# EAGLE design 8080_pod (EAGLE 6.6.0)
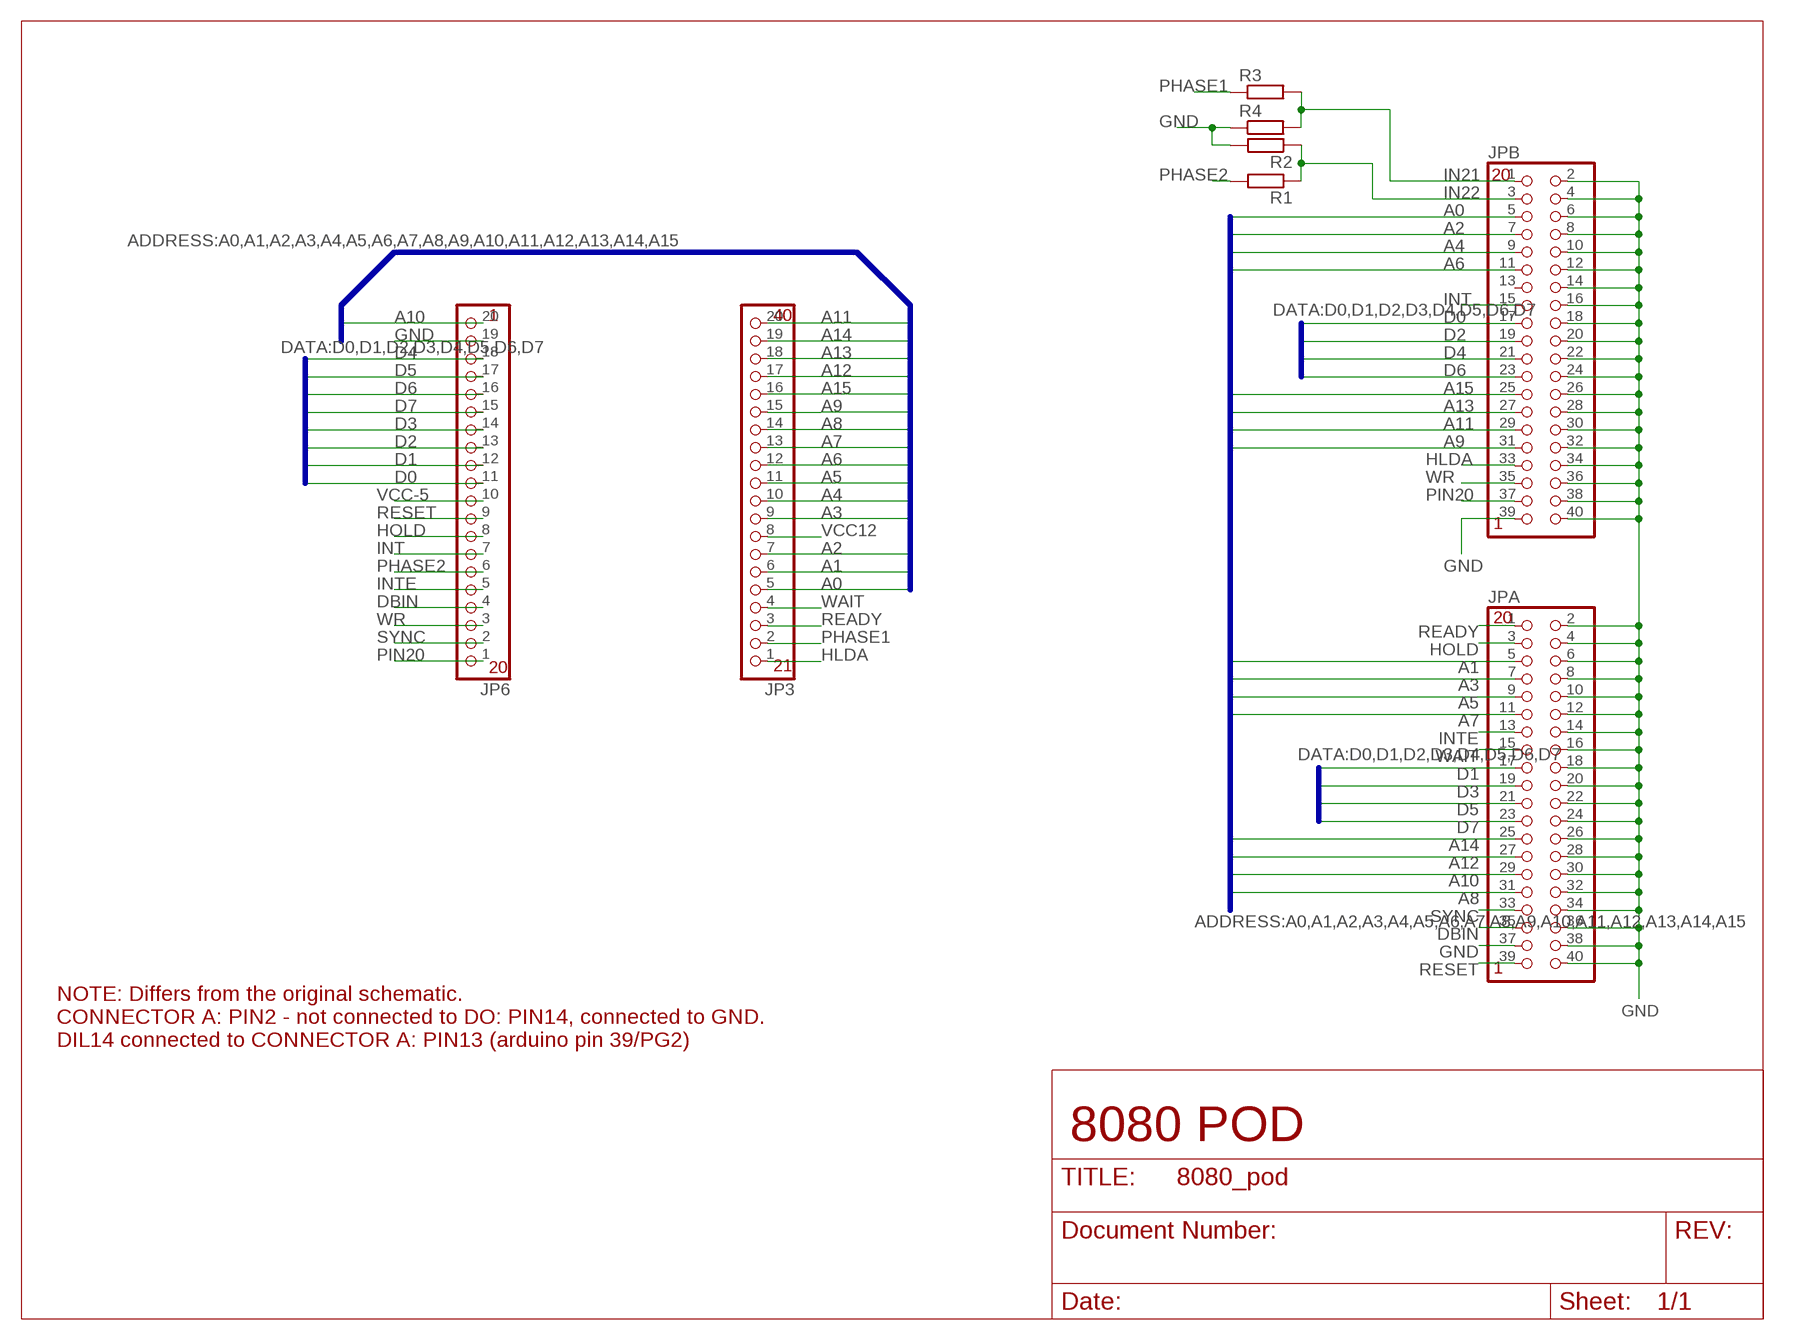
[diagram p0: schematic, sheet 1]

## Parts
JP3  PINHD-1X20-BIG  [1X20-BIG]
JP6  PINHD-1X20-BIG  [1X20-BIG]
JPA  PINHD-2X20-BIG  [2X20-BIG]
JPB  PINHD-2X20-BIG  [2X20-BIG]
R1  R-EU_0207/10  [0207/10]
R2  R-EU_0207/10  [0207/10]
R3  R-EU_0207/10  [0207/10]
R4  R-EU_0207/10  [0207/10]

## Nets
A0: JP3.5 JPB.5
A1: JP3.6 JPA.5
A2: JP3.7 JPB.7
A3: JP3.9 JPA.7
A4: JP3.10 JPB.9
A5: JP3.11 JPA.9
A6: JP3.12 JPB.11
A7: JP3.13 JPA.11
A8: JP3.14 JPA.31
A9: JP3.15 JPB.31
A10: JP6.20 JPA.29
A11: JP3.20 JPB.29
A12: JP3.17 JPA.27
A13: JP3.18 JPB.27
A14: JP3.19 JPA.25
A15: JP3.16 JPB.25
D0: JP6.11 JPB.17
D1: JP6.12 JPA.17
D2: JP6.13 JPB.19
D3: JP6.14 JPA.19
D4: JP6.18 JPB.21
D5: JP6.17 JPA.21
D6: JP6.16 JPB.23
D7: JP6.15 JPA.23
DBIN: JP6.4 JPA.35
GND: JP6.19 JPA.2 JPA.4 JPA.6 JPA.8 JPA.10 JPA.12 JPA.14 JPA.16 JPA.18 JPA.20 JPA.22 JPA.24 JPA.26 JPA.28 JPA.30 JPA.32 JPA.34 JPA.36 JPA.37 JPA.38 JPA.40 JPB.2 JPB.4 JPB.6 JPB.8 JPB.10 JPB.12 JPB.14 JPB.16 JPB.18 JPB.20 JPB.22 JPB.24 JPB.26 JPB.28 JPB.30 JPB.32 JPB.34 JPB.36 JPB.38 JPB.39 JPB.40 R2.2 R4.1
HLDA: JP3.1 JPB.33
HOLD: JP6.8 JPA.3
IN21: JPB.1 R3.2 R4.2
IN22: JPB.3 R1.1 R2.1
INT: JP6.7 JPB.15
INTE: JP6.5 JPA.13
PHASE1: JP3.2 R3.1
PHASE2: JP6.6 R1.2
PIN20: JP6.1 JPB.37
READY: JP3.3 JPA.1
RESET: JP6.9 JPA.39
SYNC: JP6.2 JPA.33
VCC12: JP3.8
VCC-5: JP6.10
WAIT: JP3.4 JPA.15
WR: JP6.3 JPB.35
Unconnected: JPB.13

## Buses
DATA:D0,D1,D2,D3,D4,D5,D6,D7
ADDRESS:A0,A1,A2,A3,A4,A5,A6,A7,A8,A9,A10,A11,A12,A13,A14,A15

## Notes on the sheet
- 20
- 1 | 40
- 1
- 20
- 20 | 21
- 1
- NOTE: Differs from the original schematic.
  CONNECTOR A: PIN2 - not connected to DO: PIN14, connected to GND. 
  DIL14 connected to CONNECTOR A: PIN13 (arduino pin 39/PG2)
- 8080 POD

## Library data of the parts
JP3 JP6 = adafruit:PINHD-1X20: PIN HEADER
JPA JPB = adafruit:PINHD-2X20: PIN HEADER
R1-R4 = rcl:R-EU_: RESISTOR, European symbol

## Board
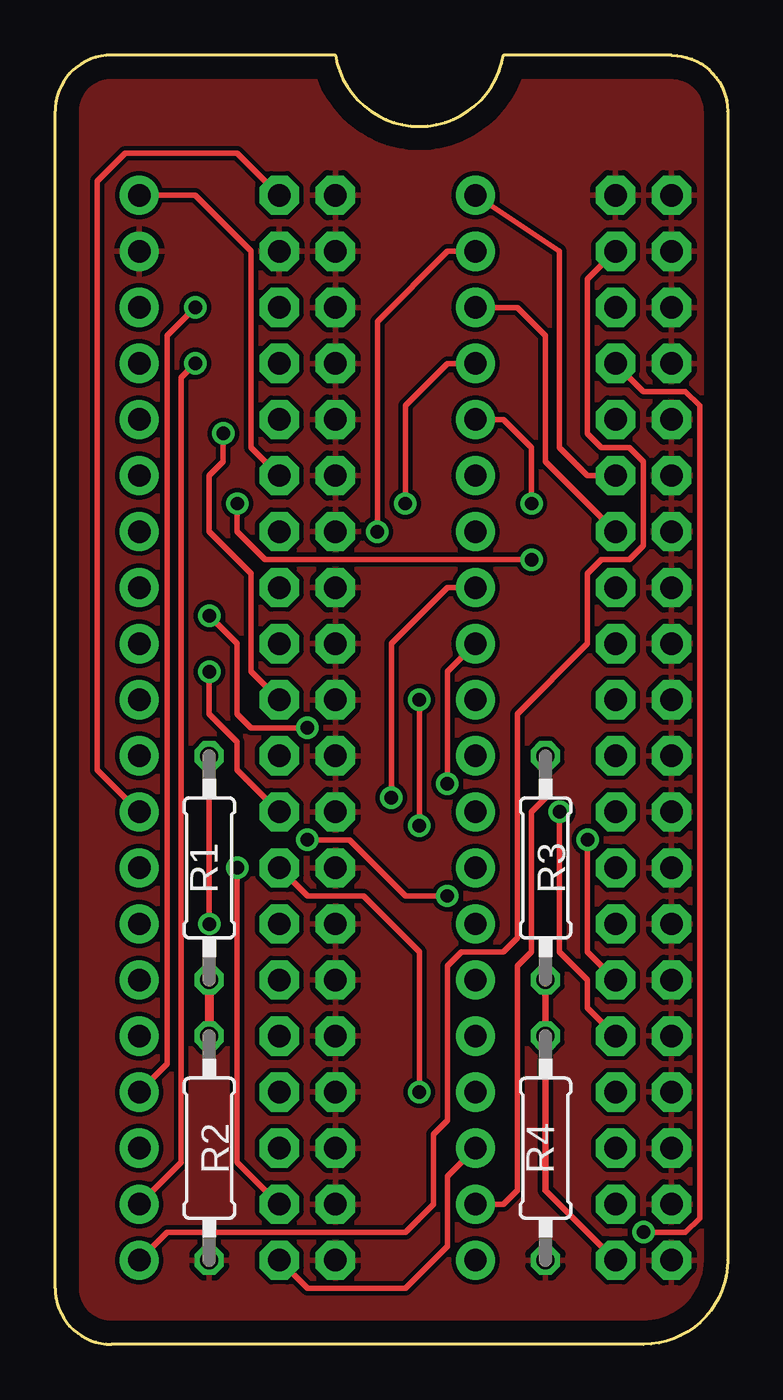
[diagram p1: board, top side]
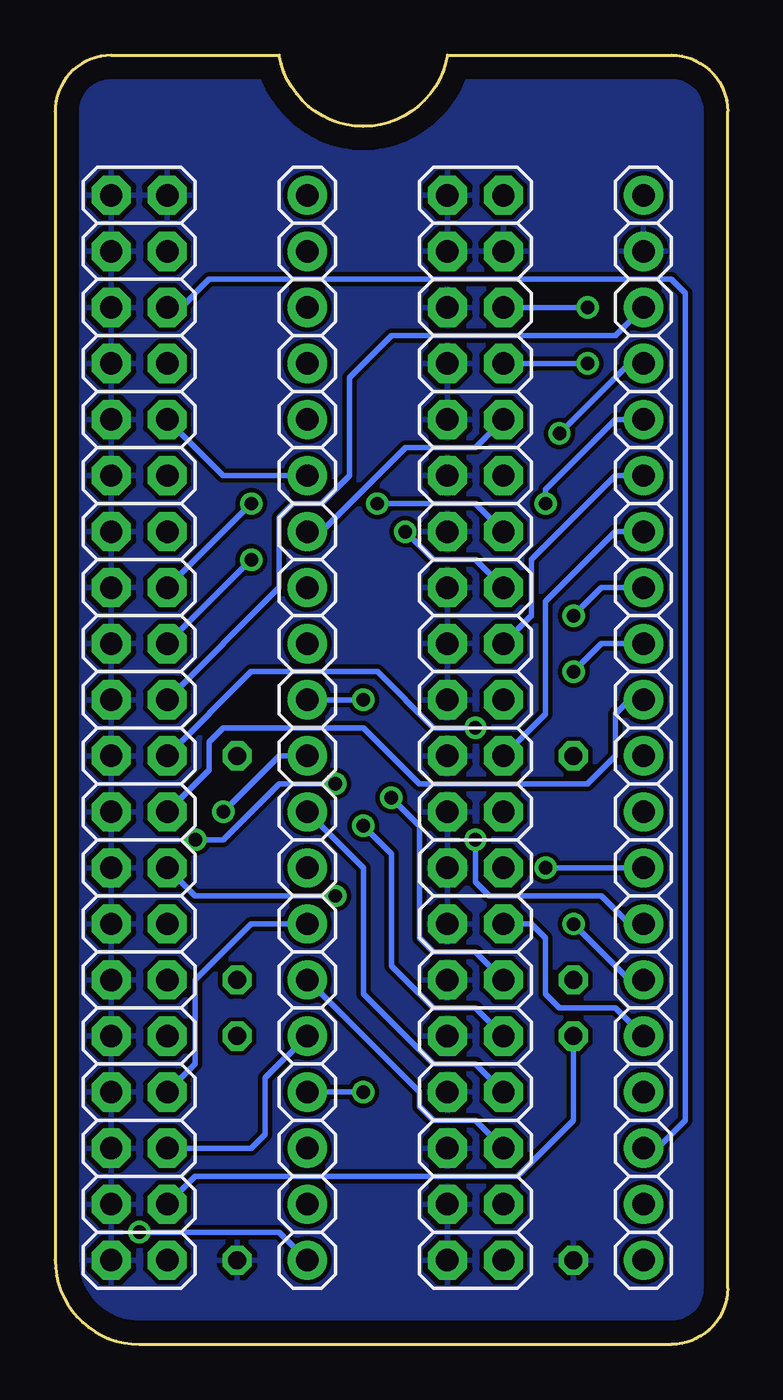
[diagram p2: board, bottom side, seen from below]

Size 30.48 x 58.42 mm. Coordinates in mm from the lower left corner, seen from the top.
Outline: 0,2.56 0,55.86
Outline: 27.95,58.41 arc-90 30.48,55.88 30.48,3.81 arc-90 26.67,0 2.54,0 arc-90 0,2.54
Outline: 27.94,58.42 20.32,58.42 arc-161 12.7,58.42 2.54,58.42 arc90 0,55.88
Copper layers (1*16): Top 0.035mm / dielectric 1.5mm / Bottom 0.035mm
Design rules "default": minimum track width 10mil, minimum drill 24mil, track to track 8mil, track to pad 8mil, pad to pad 8mil, via to via 8mil, smd to smd 8mil, copper to edge 40mil, drill to drill 8mil, minimum pad ring 10mil, minimum via ring 8mil, stop-mask expansion 4mil, vias tented up to drill 0mil, thermal gap 10mil

### Footprints (pad centres in the part's own frame; a part is rotated, then mirrored left to right if it is on the bottom)
1X20-BIG = drill 1.016 pad 1.778: 1 -24.13,0; 2 -21.59,0; 3 -19.05,0; 4 -16.51,0; 5 -13.97,0; 6 -11.43,0; 7 -8.89,0; 8 -6.35,0; 9 -3.81,0; 10 -1.27,0; 11 1.27,0; 12 3.81,0; 13 6.35,0; 14 8.89,0; 15 11.43,0; 16 13.97,0; 17 16.51,0; 18 19.05,0; 19 21.59,0; 20 24.13,0
2X20-BIG = drill 1.016 pad 1.778 octagon: 1 -24.13,-1.27; 2 -24.13,1.27; 3 -21.59,-1.27; 4 -21.59,1.27; 5 -19.05,-1.27; 6 -19.05,1.27; 7 -16.51,-1.27; 8 -16.51,1.27; 9 -13.97,-1.27; 10 -13.97,1.27; 11 -11.43,-1.27; 12 -11.43,1.27; 13 -8.89,-1.27; 14 -8.89,1.27; 15 -6.35,-1.27; 16 -6.35,1.27; 17 -3.81,-1.27; 18 -3.81,1.27; 19 -1.27,-1.27; 20 -1.27,1.27; 21 1.27,-1.27; 22 1.27,1.27; 23 3.81,-1.27; 24 3.81,1.27; 25 6.35,-1.27; 26 6.35,1.27; 27 8.89,-1.27; 28 8.89,1.27; 29 11.43,-1.27; 30 11.43,1.27; 31 13.97,-1.27; 32 13.97,1.27; 33 16.51,-1.27; 34 16.51,1.27; 35 19.05,-1.27; 36 19.05,1.27; 37 21.59,-1.27; 38 21.59,1.27; 39 24.13,-1.27; 40 24.13,1.27
0207/10 = drill 0.813 octagon: 1 -5.08,0; 2 5.08,0

### Placement (x,y rotation side)
JP3  19.05,27.94 90 bottom
JP6  3.81,27.94 90 bottom
JPA  11.43,27.94 90 bottom
JPB  26.67,27.94 90 bottom
R1  6.98,21.59 90 top
R2  6.98,8.89 270 top
R3  22.23,21.59 270 top
R4  22.23,8.89 90 top

### Tracks (layer width: path | path; a pad name or v marks a point on that pad's centre or on a via)
A0
  Bottom 0.254: JP3.5 20.95,12.06 20.95,9.53 21.59,8.89 JPB.5
A1
  Bottom 0.254: JPA.5 11.43,10.16 13.33,10.16 13.97,10.79 13.97,11.43 JP3.6
A2
  Bottom 0.254: JPB.7 24.13,12.7 24.13,16.51 21.59,19.05 JP3.7
A3
  Bottom 0.254: JPA.7 11.43,12.7 13.33,12.7 16.51,15.88 16.51,21.59 JP3.9
A4  (via drill 0.61)
  Top 0.254: v22.86,24.13 22.86,17.78 24.13,16.51 24.13,15.24 JPB.9
  Bottom 0.254: JP3.10 20.32,26.67 v22.86,24.13
A5  (via drill 0.61)
  Top 0.254: v16.51,29.21 v16.51,23.5
  Bottom 0.254: JPA.9 11.43,15.24 13.33,15.24 15.24,17.14 15.24,22.23 v16.51,23.5 | JP3.11 v16.51,29.21
A6  (via drill 0.61)
  Top 0.254: JP3.12 17.78,30.48 v17.78,25.4 | v24.13,22.86 24.13,17.78 JPB.11
  Bottom 0.254: v17.78,25.4 20.32,25.4 22.86,22.86 v24.13,22.86
A7  (via drill 0.61)
  Top 0.254: v15.24,24.77 15.24,31.75 17.78,34.29 JP3.13
  Bottom 0.254: JPA.11 11.43,17.78 13.33,17.78 13.97,18.41 13.97,23.5 v15.24,24.77
A8
  Bottom 0.254: JPA.31 11.43,40.64 14.6,40.64 18.41,36.83 JP3.14
A9
  Bottom 0.254: JP3.15 22.86,39.37 JPB.31
A10
  Top 0.254: JP6.20 6.35,52.07 8.89,49.53 8.89,40.64 JPA.29
A11
  Top 0.254: JP3.20 22.86,49.53 22.86,40.64 24.13,39.37 JPB.29
A12  (via drill 0.61)
  Top 0.254: v15.87,38.1 15.87,42.55 17.78,44.45 JP3.17
  Bottom 0.254: JPA.27 11.43,38.1 v15.87,38.1
A13
  Top 0.254: JP3.18 20.95,46.99 22.23,45.72 22.23,40.01 JPB.27
A14  (via drill 0.61)
  Top 0.254: v14.6,36.83 14.6,46.35 17.78,49.53 JP3.19
  Bottom 0.254: JPA.25 11.43,35.56 13.33,35.56 v14.6,36.83
A15  (via drill 0.61)
  Top 0.254: v21.59,38.1 21.59,40.64 20.32,41.91 JP3.16
  Bottom 0.254: v21.59,38.1 JPB.25
D0
  Bottom 0.254: JP6.11 4.45,29.21 5.08,28.57 5.08,26.67 6.35,25.4 13.97,25.4 16.51,27.94 22.86,27.94 23.49,27.3 23.49,26.04 JPB.17
D1  (via drill 0.61)
  Top 0.254: JPA.17 8.26,26.04 8.26,27.3 6.98,28.57 v6.98,30.48
  Bottom 0.254: JP6.12 5.71,31.75 v6.98,30.48
D2  (via drill 0.61)
  Top 0.254: v11.43,27.94 8.89,27.94 8.26,28.57 8.26,31.75 v6.98,33.02
  Bottom 0.254: JPB.19 21.59,30.48 15.87,30.48 13.33,27.94 v11.43,27.94 | v6.98,33.02 5.71,34.29 JP6.13
D3
  Bottom 0.254: JP6.14 5.08,36.83 8.26,33.66 8.26,28.57 JPA.19
D4
  Bottom 0.254: JP6.18 5.08,45.72 15.24,45.72 17.15,43.81 17.15,39.37 18.41,38.1 19.69,38.1 20.32,37.47 20.32,34.29 JPB.21
D5  (via drill 0.61)
  Top 0.254: v7.62,41.27 7.62,40.01 6.98,39.37 6.98,36.83 8.89,34.92 8.89,30.48 JPA.21
  Bottom 0.254: JP6.17 4.45,44.45 v7.62,41.27
D6  (via drill 0.61)
  Top 0.254: v8.26,38.1 8.26,36.83 9.53,35.56 v21.59,35.56
  Bottom 0.254: v8.26,38.1 8.26,38.73 5.08,41.91 JP6.16 | JPB.23 v21.59,35.56
D7
  Bottom 0.254: JP6.15 5.08,39.37 8.89,35.56 8.89,33.02 JPA.23
DBIN  (via drill 0.61)
  Top 0.254: JP6.4 5.08,12.7 5.08,45.72 v6.35,46.99
  Bottom 0.254: v6.35,46.99 JPA.35
GND
  pour Top: 30.48,0 0,0 0,58.42 30.48,58.42
  pour Bottom: 30.48,0 0,0 0,58.42 30.48,58.42
HLDA  (via drill 0.61)
  Top 0.254: v26.67,5.08 28.58,5.08 29.21,5.71 29.21,42.55 28.58,43.18 26.67,43.18 JPB.33
  Bottom 0.254: v26.67,5.08 20.32,5.08 JP3.1
HOLD  (via drill 0.61)
  Top 0.254: JPA.3 8.26,8.26 v8.26,21.59
  Bottom 0.254: v8.26,21.59 JP6.8
IN21
  Top 0.305: R3.2 R4.2 22.23,6.99 JPB.1
IN22
  Top 0.406: R1.1 R2.1
  Bottom 0.254: JPB.3 24.13,7.62 9.53,7.62 6.98,10.16 R2.1
INT  (via drill 0.61)
  Top 0.254: v11.43,22.86 13.33,22.86 15.87,20.32 v17.78,20.32
  Bottom 0.254: JP6.7 4.45,19.05 5.71,20.32 10.79,20.32 11.43,20.95 v11.43,22.86 | v17.78,20.32 24.13,20.32 JPB.15
INTE
  Bottom 0.254: JP6.5 5.08,15.24 7.62,15.24 8.26,15.88 8.26,18.41 8.89,19.05 JPA.13
PHASE1
  Top 0.254: R3.1 22.23,24.77 21.59,24.13 21.59,17.78 20.95,17.14 20.95,6.99 20.32,6.35 JP3.2
PHASE2  (via drill 0.61)
  Top 0.254: v6.98,19.05 R1.2
  Bottom 0.254: JP6.6 4.45,16.51 v6.98,19.05
PIN20
  Top 0.254: JP6.1 5.08,5.08 15.87,5.08 17.15,6.35 17.15,9.53 17.78,10.16 17.78,17.14 18.41,17.78 20.32,17.78 20.95,18.41 20.95,28.57 24.13,31.75 24.13,34.92 24.77,35.56 26.03,35.56 26.67,36.2 26.67,40.01 26.03,40.64 24.77,40.64 24.13,41.27 24.13,48.26 JPB.37
READY
  Top 0.254: JP3.3 17.78,7.62 17.78,4.45 15.87,2.54 11.43,2.54 JPA.1
RESET
  Top 0.254: JP6.9 1.91,26.04 1.91,52.7 3.18,53.98 8.26,53.98 JPA.39
SYNC  (via drill 0.61)
  Top 0.254: JP6.2 5.71,8.26 5.71,43.81 v6.35,44.45
  Bottom 0.254: v6.35,44.45 JPA.33
WAIT  (via drill 0.61)
  Top 0.254: v16.51,11.43 16.51,17.78 13.97,20.32 11.43,20.32 JPA.15
  Bottom 0.254: v16.51,11.43 JP3.4
WR
  Bottom 0.254: JP6.3 3.18,8.89 1.91,10.16 1.91,47.62 2.54,48.26 23.49,48.26 24.77,46.99 JPB.35

### Text on the board
tDocu: A | B | 1 | 1 | 40 | www.zzzaccaria.com | In Circuit Test 8080 V1.00 (LabRat) | 20 | 21
bDocu: 2020-12-09 | Layout by | LabRat